# Altium project General board.PrjPcb
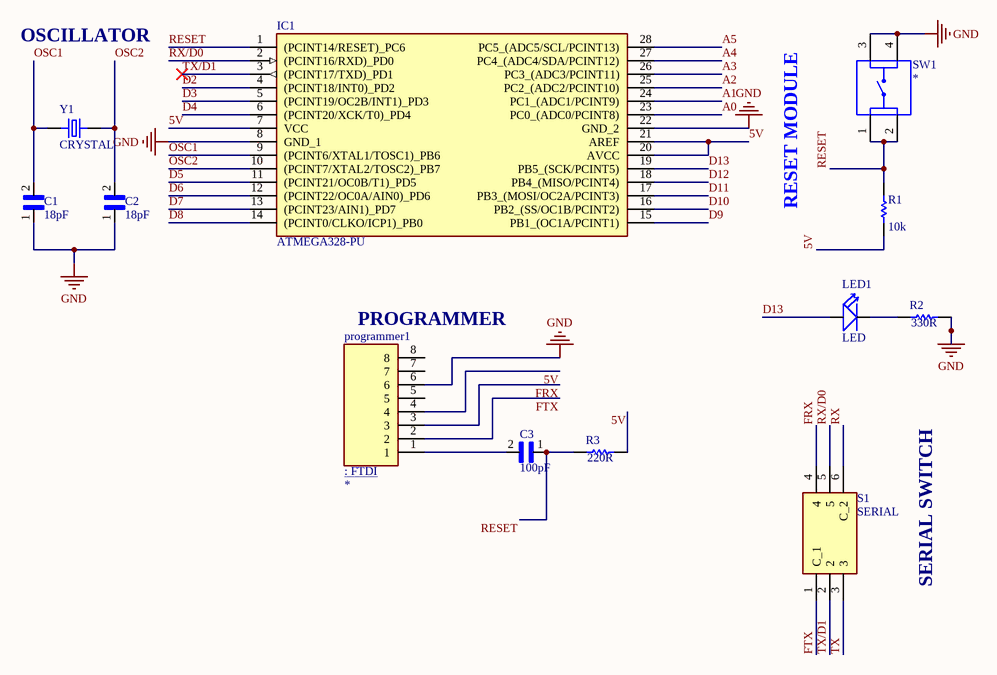
[diagram p0: CONTROLLER SECTION.SchDoc]
4 sheets, 61 parts. Net scope: global (net labels, ports and power ports of the same name join across sheets).
Board file: PCB2.PcbDoc
Sheets:
  CONTROLLER SECTION.SchDoc
  POWER SECTION.SchDoc
  INPUT SECTION.SchDoc
  OUTPUT SECTION.SchDoc

## Sheet CONTROLLER SECTION.SchDoc
size A4 portrait; Organization: Altium Limited; Address1: L3, 12a Rodborough Rd; Address2: Frenchs Forest; Address3: NSW; Address4: Australia 2086

### Parts
C1  18pF  [CAP_DE21XSA100KN3AY02F]
C2  18pF  [CAP_DE21XSA100KN3AY02F]
C3  100pF  [CAP_DE21XSA100KN3AY02F]
IC1  ATMEGA328-PU  [DIP1016W53P254L3468H457Q28N]
LED1  LED  [LED2-2.54-D10MM]
programmer1  87247-8  [TE_87247-8]  (value not drawn)
R1  value 10k  [AXIAL-0.5]
R2  value 330R  [AXIAL-0.5]
R3  value 220R  [AXIAL-0.5]
S1  SERIAL  [MPSA22E080150]
SW1  1825910-6  [SW_1825910-6-4]  (value not drawn)
Y1  CRYSTAL  [XTAL_ECS-60-20-4VX]

### Nets
GND: C1.1 C2.1 IC1.8(GND_1) IC1.22(GND_2) programmer1.6 R2.2 SW1.3 SW1.4
5V: IC1.7(VCC) IC1.20(AVCC) IC1.21(AREF) programmer1.4 R1.1 R3.1
A0: IC1.23(PC0_(ADC0/PCINT8))
A1: IC1.24(PC1_(ADC1/PCINT9))
A2: IC1.25(PC2_(ADC2/PCINT10))
A3: IC1.26(PC3_(ADC3/PCINT11))
A4: IC1.27(PC4_(ADC4/SDA/PCINT12))
A5: IC1.28(PC5_(ADC5/SCL/PCINT13))
D2: IC1.4((PCINT18/INT0)_PD2)
D3: IC1.5((PCINT19/OC2B/INT1)_PD3)
D4: IC1.6((PCINT20/XCK/T0)_PD4)
D5: IC1.11((PCINT21/OC0B/T1)_PD5)
D6: IC1.12((PCINT22/OC0A/AIN0)_PD6)
D7: IC1.13((PCINT23/AIN1)_PD7)
D8: IC1.14((PCINT0/CLKO/ICP1)_PB0)
D9: IC1.15(PB1_(OC1A/PCINT1))
D10: IC1.16(PB2_(SS/OC1B/PCINT2))
D11: IC1.17(PB3_(MOSI/OC2A/PCINT3))
D12: IC1.18(PB4_(MISO/PCINT4))
D13: IC1.19(PB5_(SCK/PCINT5)) LED1.POS
FRX: programmer1.3 S1.4
FTX: programmer1.2 S1.1(C_1)
OSC1: C1.2 IC1.9((PCINT6/XTAL1/TOSC1)_PB6) Y1.1
OSC2: C2.2 IC1.10((PCINT7/XTAL2/TOSC2)_PB7) Y1.2
RESET: C3.1 IC1.1((PCINT14/RESET)_PC6) R1.2 R3.2 SW1.1 SW1.2
RX: S1.6(C_2)
RX/D0: IC1.2((PCINT16/RXD)_PD0) S1.5
TX: S1.3
TX/D1: IC1.3((PCINT17/TXD)_PD1) S1.2
NetC3_2: C3.2 programmer1.1
NetLED1_NEG: LED1.NEG R2.1

Not connected (* = marked no-connect by the designer): programmer1 5 7 8

### Notes on the sheet
- OSCILLATOR
- RESET MODULE
- (near programmer1) PROGRAMMER
- SERIAL SWITCH
- Title
- Size:
- Date:
- A4
- Number:
- Time:
- Revision:
- Sheet
- of
- File:
- (in symbol 87247-8) FTDI

### Library data of the parts
C1-C3 = DE21XSA100KN3AY02F: Package: None; Price: None; Value: *; MP: DE21XSA100KN3AY02F; Availability: Unavailable
IC1 = ATMEGA328-PU: Integrated Circuit; Manufacturer_Name: Microchip; Datasheet Link: https://componentsearchengine.com/Datasheets/1/ATMEGA328-PU.pdf; Height: 4.572mm; Manufacturer_Part_Number: ATMEGA328-PU; Arrow Part Number: ATMEGA328-PU; Arrow Price/Stock: https://www.arrow.com/en/products/atmega328-pu/microchip-technology; Mouser Part Number: 556-ATMEGA328-PU; Mouser Price/Stock: https://www.mouser.co.uk/ProductDetail/Microchip-Technology-Atmel/ATMEGA328-PU?qs=lwdSMh1%2FoYJT8tfItQpQtA%3D%3D
LED1 = DIP-LED-GREEN-VAPOROUS-GREEN-10MM(2P-D10MM): DIP LED Green-Vaporous Green-10mm; MF: Chengguangxing; MP: G1004DC; Package: None; Value: *; SnapEDA_Link: https://www.snapeda.com/parts/G1004DC/Chengguangxing/view-part/106403/?ref=snap; Availability: Unavailable; Price: None
programmer1 = 87247-8: Connector Header Through Hole 8 position 0.156 (3.96mm); MF: TE Connectivity; SnapEDA_Link: https://www.snapeda.com/parts/87247-8/TE%20Connectivity%20AMP%20Connectors/view-part/2388036/?ref=snap; EU_RoHS_Compliance: Compliant; Value: *; Availability: Good; Purchase-URL: https://pricing.snapeda.com/search/part/87247-8/?ref=eda; Price: None; MP: 87247-8; Package: None; Comment_1: *
R1-R3 = Res Semi: Semiconductor Resistor; Published: 8-Jun-2000; LatestRevisionDate: 17-Jul-2002; LatestRevisionNote: Re-released for DXP Platform.; PackageReference: AXIAL-0.5; Publisher: Altium Limited; PackageDescription: Axial Device, Thru-Hole; 2 Leads; 0.5 in Pin Spacing
S1 = MPSA-22E08-0150: Switch; Manufacturer_Name: KNITTER-SWITCH; Datasheet Link: http://www.knitter-switch.com/eng/Series/17?search=MPSA-22E08-0150; Height: 8mm; Manufacturer_Part_Number: MPSA-22E08-0150
SW1 = 1825910-6: Switch Push Button OFF _ON_ SPST Round Button 0.05A 24VDC Momentary Contact PC Pins Thru-Hole; Configuration_Pole-Throw: Single Pole - Single Throw; MF: TE Connectivity; Contact_Current_Rating: 50 mA; Digi-Key_Purchase_URL: https://www.digikey.com/product-detail/en/te-connectivity-alcoswitch-switches/1825910-6/450-1650-ND/1632536?utm_source=snapeda&utm_medium=aggregator&utm_campaign=symbol; TE_purchase_URL: https://www.te.com/usa-en/product-1825910-6.html?te_bu=Cor&te_type=disp&te_campaign=seda_glo_cor-seda-global-disp-prtnr-fy19-seda-model-bom-cta_sma-317_1&elqCampaignId=32493; Value: *; Digi-Key_Part_Number: 450-1650-ND; SnapEDA_Link: https://www.snapeda.com/parts/1825910-6/TE%20Connectivity%20ALCOSWITCH%20Switches/view-part/424522/?ref=snap; EU_RoHS_Compliance: Compliant; MP: 1825910-6; Package: None; Comment_1: *
Y1 = ECS-200-20-4VX: 20MHz Â±30ppm Crystal 20pF 40 Ohms HC-49/US; MF: ECS International; SnapEDA_Link: https://www.snapeda.com/parts/ECS-200-20-4VX/ECS%20International/view-part/47294/?ref=snap; Price: None; MP: ECS-200-20-4VX; Value: *; Availability: Unavailable; Package: HC49/US ECS International

## Sheet POWER SECTION.SchDoc
size A4; Organization: Altium Limited; Address1: L3, 12a Rodborough Rd; Address2: Frenchs Forest; Address3: NSW; Address4: Australia 2086
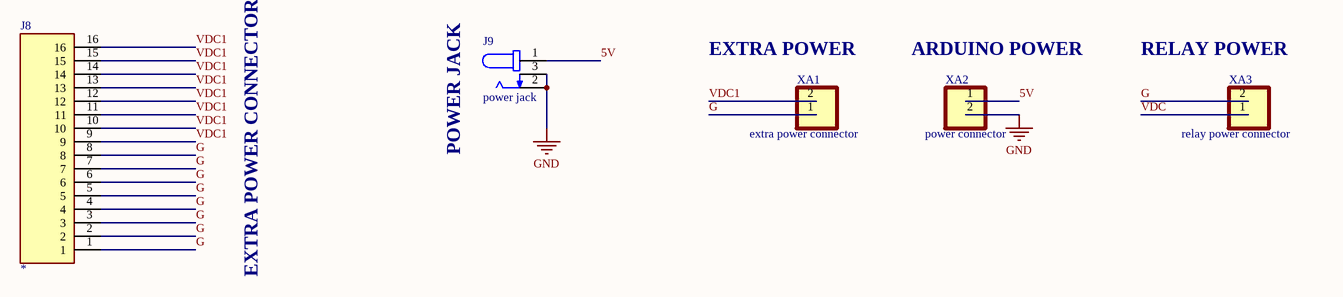
[diagram p1: POWER SECTION.SchDoc]

### Parts
J8  1-215297-6  [TE_1-215297-6]  (value not drawn)
J9  power jack  [CUI_PJ-202A]
XA1  extra power connector  [PHOENIX_MKDS1/2-3.81]
XA2  power connector  [PHOENIX_MKDS1/2-3.81]
XA3  relay power connector  [PHOENIX_MKDS1/2-3.81]

### Nets
GND: J9.2 J9.3 XA2.2
5V: J9.1 XA2.1
G: J8.1 J8.2 J8.3 J8.4 J8.5 J8.6 J8.7 J8.8 XA1.1 XA3.2
VDC: XA3.1
VDC1: J8.9 J8.10 J8.11 J8.12 J8.13 J8.14 J8.15 J8.16 XA1.2

### Notes on the sheet
- (near XA1) EXTRA POWER
- (near XA2) ARDUINO POWER
- (near XA3) RELAY POWER
- POWER JACK
- EXTRA POWER CONNECTOR
- Title
- Size:
- Date:
- A4
- Number:
- Time:
- Revision:
- Sheet
- of
- File:

### Library data of the parts
J8 = 1-215297-6: Ú©Ø§Ø±ØªÙ† Ø§ØªØµØ§Ù„ Ø³ÙˆÚ©Øª Ù†ÙˆØ§Ø± SKT 16 POS 2.54 Ù…ÛŒÙ„ÛŒ Ù…ØªØ± Ù„Ø­ÛŒÙ… Ú©Ø§Ø±ÛŒ ST Thru-Hole; Number_of_Positions: 16; Centerline_Pitch: 2.54 mm[.1 in]; Product_Type: Connector; MF: TE Connectivity; Purchase-URL: https://pricing.snapeda.com/search/part/1-215297-6/?ref=eda; Package: None; MP: 1-215297-6; Value: *; Price: None; Availability: Good; SnapEDA_Link: https://www.snapeda.com/parts/1-215297-6/TE%20Connectivity%20AMP%20Connectors/view-part/449123/?ref=snap; EU_RoHS_Compliance: Compliant; Check_prices: https://www.snapeda.com/parts/1-215297-6/TE%20Connectivity%20AMP%20Connectors/view-part/449123/?ref=eda; Comment_1: *
J9 = PJ-202A: 2.0 x 6.5 mm, 2.5 A, Horizontal, Through Hole, Kinked Pins, Dc Power Jack Connector; MF: CUI Devices; Availability: Unavailable; Package: None; SnapEDA_Link: https://www.snapeda.com/parts/PJ-202A/CUI%20Devices/view-part/153805/?ref=snap; MP: PJ-202A; Price: None; CUI_purchase_URL: https://www.cuidevices.com/product/interconnect/connectors/dc-power-connectors/jacks/pj-202a?utm_source=snapeda.com&utm_medium=referral&utm_campaign=snapedaBOM; Value: *
XA1-XA3 = MKDS1/2-3.81: 2 Position Wire to Board Terminal Block Horizontal with Board 0.150 _3.81mm_ Through Hole; MF: Phoenix Contact; Package: None; Price: None; SnapEDA_Link: https://www.snapeda.com/parts/MKDS%201/%202-3.81/Phoenix%20Contact/view-part/114562/?ref=snap; Availability: Unavailable; Value: *; MP: MKDS 1/ 2-3.81

## Sheet INPUT SECTION.SchDoc
size A4; Organization: Altium Limited; Address1: L3, 12a Rodborough Rd; Address2: Frenchs Forest; Address3: NSW; Address4: Australia 2086
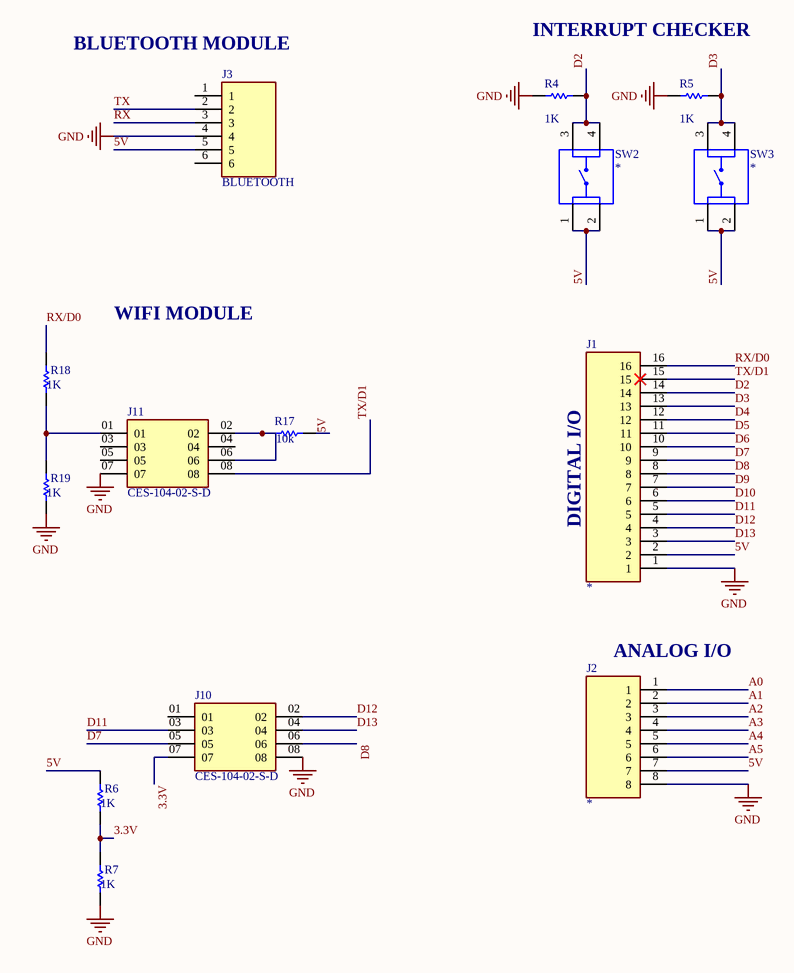
[diagram p2: INPUT SECTION.SchDoc]

### Parts
J1  1-215297-6  [TE_1-215297-6]  (value not drawn)
J2  5-534237-6  [TE_5-534237-6]  (value not drawn)
J3  BLUETOOTH  [HDRV6W70P0X254_1X6_1564X250X865P]
J10  CES-104-02-S-D  [SAMTEC_CES-104-02-S-D]
J11  CES-104-02-S-D  [SAMTEC_CES-104-02-S-D]
R4  value 1K  [AXIAL-0.5]
R5  value 1K  [AXIAL-0.5]
R6  value 1K  [AXIAL-0.5]
R7  value 1K  [AXIAL-0.5]
R17  value 10k  [AXIAL-0.5]
R18  value 1K  [AXIAL-0.5]
R19  value 1K  [AXIAL-0.5]
SW2  1825910-6  [SW_1825910-6-4]  (value not drawn)
SW3  1825910-6  [SW_1825910-6-4]  (value not drawn)

### Nets
GND: J1.1 J2.8 J3.4 J10.08 J11.07 R4.2 R5.2 R7.1 R19.1
3.3V: J10.07 R6.1 R7.2
5V: J1.2 J2.7 J3.5 R6.2 R17.1 SW2.1 SW2.2 SW3.1 SW3.2
A0: J2.1
A1: J2.2
A2: J2.3
A3: J2.4
A4: J2.5
A5: J2.6
D2: J1.14 R4.1 SW2.3 SW2.4
D3: J1.13 R5.1 SW3.3 SW3.4
D4: J1.12
D5: J1.11
D6: J1.10
D7: J1.9 J10.05
D8: J1.8 J10.06
D9: J1.7
D10: J1.6
D11: J1.5 J10.03
D12: J1.4 J10.02
D13: J1.3 J10.04
RX: J3.3
RX/D0: J1.16 R18.2
TX: J3.2
TX/D1: J1.15 J11.08
NetJ11_01: J11.01 R18.1 R19.2
NetJ11_02: J11.02 J11.06 R17.2

Not connected (* = marked no-connect by the designer): J3 1 6; J10 01; J11 03 04 05

### Notes on the sheet
- (near J3) BLUETOOTH MODULE
- INTERRUPT CHECKER
- WIFI MODULE
- DIGITAL I/O
- (near J2) ANALOG I/O
- Title
- Size:
- Date:
- A4
- Number:
- Time:
- Revision:
- Sheet
- of
- File:

### Library data of the parts
J1 = 1-215297-6: as J8 on sheet POWER SECTION; Purchase-URL: https://pricing.snapeda.com/search/part/1-215297-6/?ref=eda; Package: None; MP: 1-215297-6; Value: *; Price: None; Availability: Good; SnapEDA_Link: https://www.snapeda.com/parts/1-215297-6/TE%20Connectivity%20AMP%20Connectors/view-part/449123/?ref=snap; EU_RoHS_Compliance: Compliant; Check_prices: https://www.snapeda.com/parts/1-215297-6/TE%20Connectivity%20AMP%20Connectors/view-part/449123/?ref=eda; Comment_1: *
J2 = 5-534237-6: Connector Socket Strip Receptacle 8 Position 2.54mm Solder Straight Through Hole; Number_of_Positions: 8; MF: TE Connectivity; Centerline_Pitch: 2.54; Price: None; Value: *; Package: None; Mouser-Purchase-URL: https://snapeda.com/shop?store=Mouser&id=468085; Arrow_Electronics-Purchase-URL: https://snapeda.com/shop?store=Arrow+Electronics&id=468085; SnapEDA_Link: https://www.snapeda.com/parts/5-534237-6/TE%20Connectivity%20AMP%20Connectors/view-part/468085/?ref=snap; EU_RoHS_Compliance: Compliant; Availability: Good; Product_Type: Connector; DigiKey-Purchase-URL: https://snapeda.com/shop?store=DigiKey&id=468085; MP: 5-534237-6; Comment_1: *
J3 = M20-7820646: Connector; Manufacturer_Name: Harwin; Datasheet Link: https://cdn.harwin.com/pdfs/M20-782.pdf; Height: 8.65mm; Manufacturer_Part_Number: M20-7820646; Mouser Part Number: 855-M20-7820646; Mouser Price/Stock: https://www.mouser.co.uk/ProductDetail/Harwin/M20-7820646?qs=WS5Jv%252B%252Bx1qWZs4rbTjPGWw%3D%3D
J10 J11 = CES-104-02-S-D: 8 Position Receptacle Connector Through Hole; MF: Samtec; DigiKey-Purchase-URL: https://snapeda.com/shop?store=DigiKey&id=3430619; Package: None; Value: *; Availability: Unavailable; MP: CES-104-02-S-D; SnapEDA_Link: https://www.snapeda.com/parts/CES-104-02-S-D/Samtec/view-part/3430619/?ref=snap; Price: None
R4-R7 R17-R19 = Res Semi: Semiconductor Resistor; Published: 8-Jun-2000; LatestRevisionDate: 17-Jul-2002; LatestRevisionNote: Re-released for DXP Platform.; PackageReference: AXIAL-0.5; Publisher: Altium Limited; PackageDescription: Axial Device, Thru-Hole; 2 Leads; 0.5 in Pin Spacing
SW2 SW3 = 1825910-6: as SW1 on sheet CONTROLLER SECTION; Digi-Key_Purchase_URL: https://www.digikey.com/product-detail/en/te-connectivity-alcoswitch-switches/1825910-6/450-1650-ND/1632536?utm_source=snapeda&utm_medium=aggregator&utm_campaign=symbol; TE_purchase_URL: https://www.te.com/usa-en/product-1825910-6.html?te_bu=Cor&te_type=disp&te_campaign=seda_glo_cor-seda-global-disp-prtnr-fy19-seda-model-bom-cta_sma-317_1&elqCampaignId=32493; Value: *; Digi-Key_Part_Number: 450-1650-ND; SnapEDA_Link: https://www.snapeda.com/parts/1825910-6/TE%20Connectivity%20ALCOSWITCH%20Switches/view-part/424522/?ref=snap; EU_RoHS_Compliance: Compliant; MP: 1825910-6; Package: None; Comment_1: *

## Sheet OUTPUT SECTION.SchDoc
size A4; Organization: Altium Limited; Address1: L3, 12a Rodborough Rd; Address2: Frenchs Forest; Address3: NSW; Address4: Australia 2086
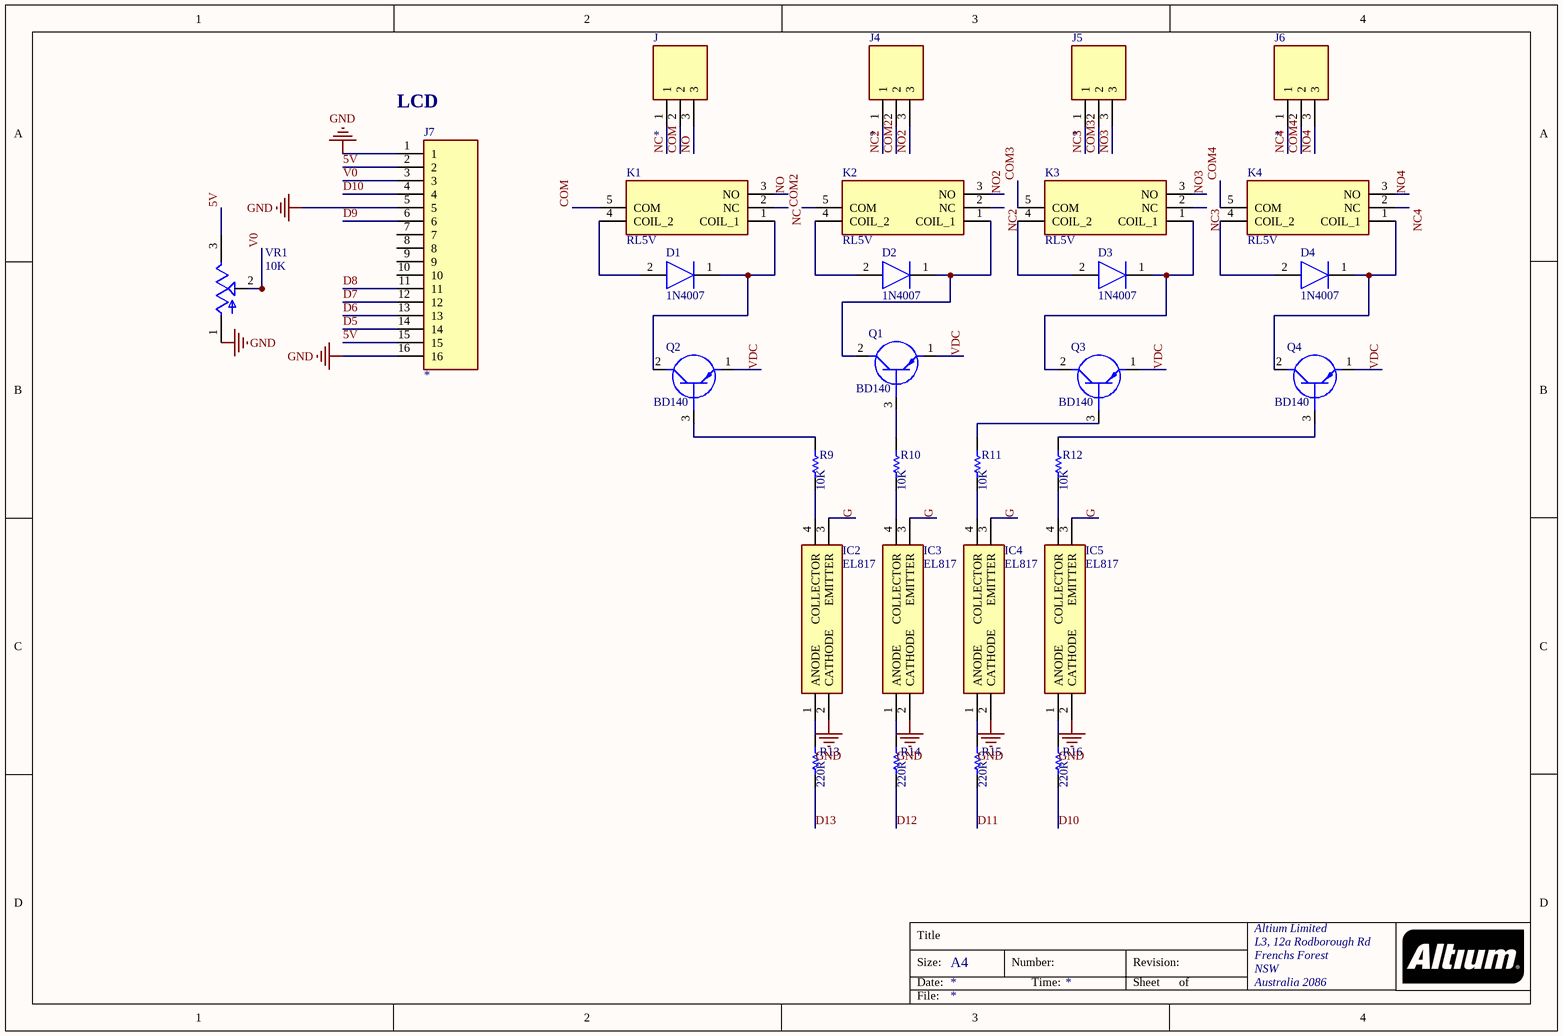
[diagram p3: OUTPUT SECTION.SchDoc]

### Parts
D1  1N4007  [DIOAD1138W56L406D183]
D2  1N4007  [DIOAD1138W56L406D183]
D3  1N4007  [DIOAD1138W56L406D183]
D4  1N4007  [DIOAD1138W56L406D183]
IC2  EL817  [DIP762W60P254L458H480Q4N]
IC3  EL817  [DIP762W60P254L458H480Q4N]
IC4  EL817  [DIP762W60P254L458H480Q4N]
IC5  EL817  [DIP762W60P254L458H480Q4N]
J  1776118-3  [TE_1776118-3]  (value not drawn)
J4  1776118-3  [TE_1776118-3]  (value not drawn)
J5  1776118-3  [TE_1776118-3]  (value not drawn)
J6  1776118-3  [TE_1776118-3]  (value not drawn)
J7  1-826646-6  [TE_1-826646-6]  (value not drawn)
K1  RL5V  [0476618]
K2  RL5V  [0476618]
K3  RL5V  [0476618]
K4  RL5V  [0476618]
Q1  BD140  [TO229P345X800X1460-3P]
Q2  BD140  [TO229P345X800X1460-3P]
Q3  BD140  [TO229P345X800X1460-3P]
Q4  BD140  [TO229P345X800X1460-3P]
R9  value 10K  [AXIAL-0.5]
R10  value 10K  [AXIAL-0.5]
R11  value 10K  [AXIAL-0.5]
R12  value 10K  [AXIAL-0.5]
R13  value 220R  [AXIAL-0.5]
R14  value 220R  [AXIAL-0.5]
R15  value 220R  [AXIAL-0.5]
R16  value 220R  [AXIAL-0.5]
VR1  10K  [TRIM_3362P-1-105]

### Nets
GND: IC2.2(CATHODE) IC3.2(CATHODE) IC4.2(CATHODE) IC5.2(CATHODE) J7.1 J7.5 J7.16 VR1.1(CCW)
5V: J7.2 J7.15 VR1.3(CW)
COM: J.2 K1.5(COM)
COM2: J4.2 K2.5(COM)
COM3: J5.2 K3.5(COM)
COM4: J6.2 K4.5(COM)
D5: J7.14
D6: J7.13
D7: J7.12
D8: J7.11
D9: J7.6
D10: J7.4 R16.1
D11: R15.1
D12: R14.1
D13: R13.1
G: IC2.3(EMITTER) IC3.3(EMITTER) IC4.3(EMITTER) IC5.3(EMITTER)
NC: J.1 K1.2(NC)
NC2: J4.1 K2.2(NC)
NC3: J5.1 K3.2(NC)
NC4: J6.1 K4.2(NC)
NO: J.3 K1.3(NO)
NO2: J4.3 K2.3(NO)
NO3: J5.3 K3.3(NO)
NO4: J6.3 K4.3(NO)
V0: J7.3 VR1.2(WIPER)
VDC: Q1.1(E) Q2.1(E) Q3.1(E) Q4.1(E)
NetD1_1: D1.1(K) K1.1(COIL_1) Q2.2(C)
NetD1_2: D1.2(A) K1.4(COIL_2)
NetD2_1: D2.1(K) K2.1(COIL_1) Q1.2(C)
NetD2_2: D2.2(A) K2.4(COIL_2)
NetD3_1: D3.1(K) K3.1(COIL_1) Q3.2(C)
NetD3_2: D3.2(A) K3.4(COIL_2)
NetD4_1: D4.1(K) K4.1(COIL_1) Q4.2(C)
NetD4_2: D4.2(A) K4.4(COIL_2)
NetIC2_1: IC2.1(ANODE) R13.2
NetIC2_4: IC2.4(COLLECTOR) R9.1
NetIC3_1: IC3.1(ANODE) R14.2
NetIC3_4: IC3.4(COLLECTOR) R10.1
NetIC4_1: IC4.1(ANODE) R15.2
NetIC4_4: IC4.4(COLLECTOR) R11.1
NetIC5_1: IC5.1(ANODE) R16.2
NetIC5_4: IC5.4(COLLECTOR) R12.1
NetQ1_3: Q1.3(B) R10.2
NetQ2_3: Q2.3(B) R9.2
NetQ3_3: Q3.3(B) R11.2
NetQ4_3: Q4.3(B) R12.2

Not connected (* = marked no-connect by the designer): J7 7 8 9 10

### Notes on the sheet
- (near J7) LCD
- Title
- Size:
- Date:
- A4
- Number:
- Time:
- Revision:
- Sheet
- of
- File:

### Library data of the parts
D1-D4 = 1N4678__DO35_: Diode; Manufacturer_Name: Microsemi Corporation; Manufacturer_Part_Number: 1N4678 (DO35); Datasheet Link: https://www.microsemi.com/document-portal/doc_download/5827-1n4678-4717-datasheet
IC2-IC5 = EL817: Integrated Circuit; Manufacturer_Name: Everlight; Datasheet Link: https://componentsearchengine.com/Datasheets/1/EL817.pdf; Height: 4.8mm; Manufacturer_Part_Number: EL817; Arrow Part Number: EL817; Arrow Price/Stock: https://www.arrow.com/en/products/el817/everlight-electronics; Mouser Part Number: 638-817; Mouser Price/Stock: https://www.mouser.co.uk/ProductDetail/Everlight/EL817?qs=vs%252BWWTB4QKYUQzCxB0orLQ%3D%3D
J J4-J6 = 1776118-3: Conn Terminal Block F 3 POS 5mm Solder ST Thru-Hole Package; Number_of_Positions: 3; Centerline_Pitch: 5 mm[.197 in]; MF: TE Connectivity; Value: *; MP: 1776118-3; SnapEDA_Link: https://www.snapeda.com/parts/1776118-3/TE%20Connectivity%20AMP%20Connectors/view-part/2375684/?ref=snap; Availability: Unavailable; Package: None; TE_purchase_URL: https://www.te.com/usa-en/product-1776118-3.html?te_bu=Cor&te_type=disp&te_campaign=seda_glo_cor-seda-global-disp-prtnr-fy19-seda-model-bom-cta_sma-317_1&elqCampaignId=32493; Price: None; EU_RoHS_Compliance: Compliant with Exemptions; Comment_1: *
J7 = 1-826646-6: Connector Header Through Hole 16 position 0.100 (2.54mm); MF: TE Connectivity; MP: 1-826646-6; Package: None; EU_RoHS_Compliance: Compliant; SnapEDA_Link: https://www.snapeda.com/parts/1-826646-6/TE%20Connectivity%20AMP%20Connectors/view-part/2412820/?ref=snap; Price: None; Availability: Warning; Value: *; Comment_1: *
K1-K4 = 0476618: Relay or Contactor; Manufacturer_Name: RS Components; Datasheet Link: https://docs-emea.rs-online.com/webdocs/1583/0900766b81583163.pdf; Height: 15mm; Manufacturer_Part_Number: 0476618
Q1-Q4 = BD14010STU: Transistor BJT PNP; Manufacturer_Name: ON Semiconductor; Datasheet Link: http://www.mouser.com/ds/2/149/BD140-888626.pdf; Height: 3.45mm; Manufacturer_Part_Number: BD14010STU; Mouser Part Number: 512-BD14010STU; Mouser Price/Stock: https://www.mouser.co.uk/ProductDetail/ON-Semiconductor-Fairchild/BD14010STU?qs=ljbEvF4DwOOnoRfj89Fh0g%3D%3D; Arrow Part Number: BD14010STU; Arrow Price/Stock: https://www.arrow.com/en/products/bd14010stu/on-semiconductor
R9-R16 = Res Semi: Semiconductor Resistor; Published: 8-Jun-2000; LatestRevisionDate: 17-Jul-2002; LatestRevisionNote: Re-released for DXP Platform.; PackageReference: AXIAL-0.5; Publisher: Altium Limited; PackageDescription: Axial Device, Thru-Hole; 2 Leads; 0.5 in Pin Spacing
VR1 = 3362P-1-105: 1 MOhms 0.5W, 1/2W PC Pins Through Hole Trimmer Potentiometer Cermet 1 Turn Top Adjustment; MF: Bourns; Value: *; Availability: Warning; SnapEDA_Link: https://www.snapeda.com/parts/3362P-1-105/Bourns/view-part/1463271/?ref=snap; Check_prices: https://www.snapeda.com/parts/3362P-1-105/Bourns/view-part/1463271/?ref=eda; Package: 3116 Bourns; Purchase-URL: https://pricing.snapeda.com/search/part/3362P-1-105/?ref=eda; MP: 3362P-1-105; Price: None

## Nets that join several sheets
GND: CONTROLLER SECTION (8 pins), POWER SECTION (J9.2 J9.3 XA2.2), INPUT SECTION (9 pins), OUTPUT SECTION (8 pins)
5V: CONTROLLER SECTION (6 pins), POWER SECTION (J9.1 XA2.1), INPUT SECTION (9 pins), OUTPUT SECTION (J7.2 J7.15 VR1.3)
A0: CONTROLLER SECTION (IC1.23), INPUT SECTION (J2.1)
A1: CONTROLLER SECTION (IC1.24), INPUT SECTION (J2.2)
A2: CONTROLLER SECTION (IC1.25), INPUT SECTION (J2.3)
A3: CONTROLLER SECTION (IC1.26), INPUT SECTION (J2.4)
A4: CONTROLLER SECTION (IC1.27), INPUT SECTION (J2.5)
A5: CONTROLLER SECTION (IC1.28), INPUT SECTION (J2.6)
D2: CONTROLLER SECTION (IC1.4), INPUT SECTION (J1.14 R4.1 SW2.3 SW2.4)
D3: CONTROLLER SECTION (IC1.5), INPUT SECTION (J1.13 R5.1 SW3.3 SW3.4)
D4: CONTROLLER SECTION (IC1.6), INPUT SECTION (J1.12)
D5: CONTROLLER SECTION (IC1.11), INPUT SECTION (J1.11), OUTPUT SECTION (J7.14)
D6: CONTROLLER SECTION (IC1.12), INPUT SECTION (J1.10), OUTPUT SECTION (J7.13)
D7: CONTROLLER SECTION (IC1.13), INPUT SECTION (J1.9 J10.05), OUTPUT SECTION (J7.12)
D8: CONTROLLER SECTION (IC1.14), INPUT SECTION (J1.8 J10.06), OUTPUT SECTION (J7.11)
D9: CONTROLLER SECTION (IC1.15), INPUT SECTION (J1.7), OUTPUT SECTION (J7.6)
D10: CONTROLLER SECTION (IC1.16), INPUT SECTION (J1.6), OUTPUT SECTION (J7.4 R16.1)
D11: CONTROLLER SECTION (IC1.17), INPUT SECTION (J1.5 J10.03), OUTPUT SECTION (R15.1)
D12: CONTROLLER SECTION (IC1.18), INPUT SECTION (J1.4 J10.02), OUTPUT SECTION (R14.1)
D13: CONTROLLER SECTION (IC1.19 LED1.POS), INPUT SECTION (J1.3 J10.04), OUTPUT SECTION (R13.1)
G: POWER SECTION (10 pins), OUTPUT SECTION (IC2.3 IC3.3 IC4.3 IC5.3)
RX: CONTROLLER SECTION (S1.6), INPUT SECTION (J3.3)
RX/D0: CONTROLLER SECTION (IC1.2 S1.5), INPUT SECTION (J1.16 R18.2)
TX: CONTROLLER SECTION (S1.3), INPUT SECTION (J3.2)
TX/D1: CONTROLLER SECTION (IC1.3 S1.2), INPUT SECTION (J1.15 J11.08)
VDC: POWER SECTION (XA3.1), OUTPUT SECTION (Q1.1 Q2.1 Q3.1 Q4.1)